# Altium project PCB_Project.PrjPcb
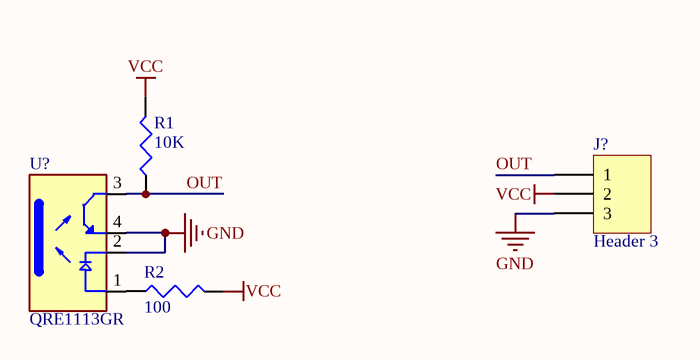
[diagram p0: borda_sch.SchDoc]
1 sheet, 4 parts. Net scope: global (net labels, ports and power ports of the same name join across sheets).
Board file: borda_pcb.PcbDoc

## Sheet borda_sch.SchDoc
size A4; SheetNumber: 1; SheetTotal: 1

### Parts
J?  Header 3  [HDR1X3 THT]
QRE  QRE1113GR  [SOIC180P460X187-4N]
R1  value 10K  [Resistor SMD 0603]  (hidden comment: Resistor SMD)
R2  value 100  [Resistor SMD 0603]  (hidden comment: Resistor SMD)

### Nets
GND: J?.3 QRE.2(C) QRE.4(ET)
VCC: J?.2 R1.2 R2.2
OUT: J?.1 QRE.3(CT) R1.1
NetQRE_1: QRE.1(A) R2.1

### Library data of the parts
J? = Header 3: Header, 3-Pin; LatestRevisionDate: 17-Jul-2002; LatestRevisionNote: Re-released for DXP Platform.; Publisher: Altium Limited
QRE = QRE1113GR: Reflective Optical Sensor 0.039 (1mm) 4-SMD, Gull Wing; MF: ON Semiconductor
R1 R2 = Resistor SMD: Resistor SMD com os tamanhos 0603, 0805, 1206 e 1210; Size: 0603